# EasyEDA Pro project 四路舵机降压板.epro, schematic lm3150
Board Name: lm3150; Create Date: 2025-05-26; Page Name: P1; Project Name: 四路舵机降压板; Schematic Name: lm3150; Update Date: 2025-05-26; Company: 嘉立创EDA; Page Size: A4; Version: V1.0
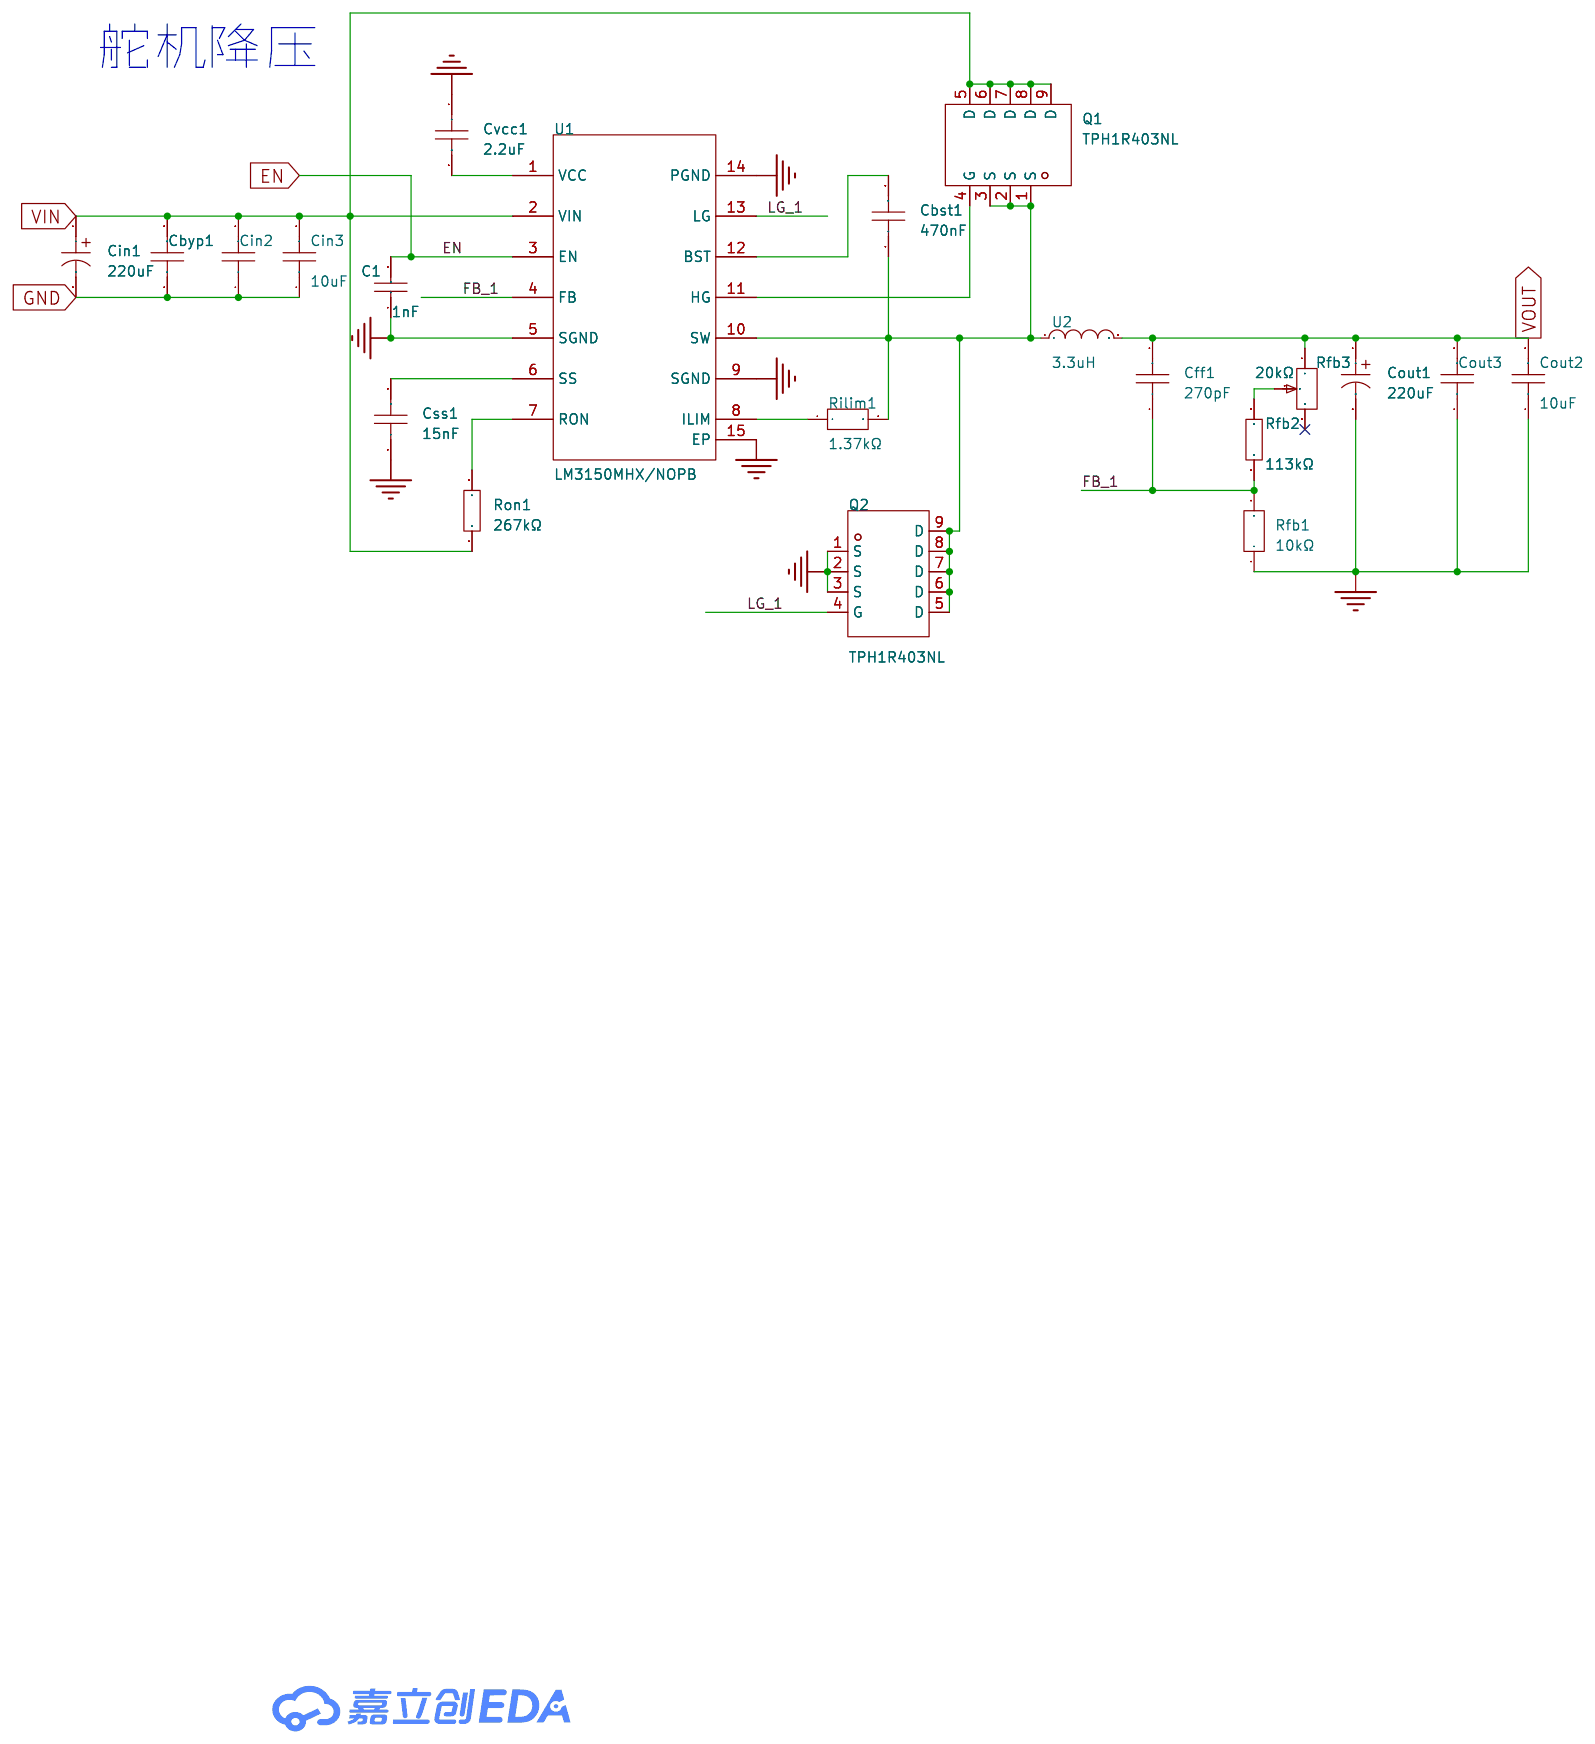
[diagram p2: schematic sheet]

## Parts
C1  1nF  [C0603]
Cbst1  470nF  [CAP-SMD_L1.6-W0.8-3]
Cbyp1  100nF  [C0603]
Cff1  270pF  [C0603]
Cin1  220uF  [CAP-SMD_BD6.3-L6.6-W6.6-LS7.4-FD]
Cin2  100nF  [C0603]
Cin3  10uF  [C0805]
Cout1  220uF  [CAP-SMD_BD6.3-L6.6-W6.6-LS7.4-FD]
Cout2  10uF  [C0805]
Cout3  100nF  [C0603]
Css1  15nF  [C0603]
Cvcc1  2.2uF  [C0805]
Q1  TPH1R403NL  [DSOP-8_L5.0-W5.0-P1.27-LS6.0-BL-EP]
Q2  TPH1R403NL  [DSOP-8_L5.0-W5.0-P1.27-LS6.0-BL-EP]
Rfb1  10kΩ  [R0603]
Rfb2  113kΩ  [R0603]
Rfb3  20kΩ  [RES-ADJ-TH_3362P]
Rilim1  1.37kΩ  [R0603]
Ron1  267kΩ  [R0603]
U1  LM3150MHX/NOPB  [HTSSOP-14_L5.0-W4.4-P0.65-LS6.4-BL-EP]
U2  3.3uH  [IND-SMD_L7.8-W7.6]

## Library data of the parts
C1 = CL10B102KB8NNNC: 容值:1nF;精度:±10%;额定电压:50V;材质(温度系数):X7R;; LCSC Part Name: 1nF ±10% 50V; Supplier Part: C1588; Manufacturer: SAMSUNG(三星); Supplier Footprint: 0603; JLCPCB Part Class: 基础库; Datasheet: https://atta.szlcsc.com/upload/public/pdf/source/20160218/1457707763339.pdf; Supplier: LCSC; Tolerance: ±10%; Voltage Rated: 50V; Temperature Coefficient: X7R
Cbst1 = CC0603KRX7R9BB474: 容值:470nF;精度:±10%;额定电压:50V;材质(温度系数):X7R;; LCSC Part Name: 470nF ±10% 50V; Supplier Part: C513577; Manufacturer: YAGEO(国巨); Supplier Footprint: 0603; JLCPCB Part Class: 扩展库; Datasheet: https://atta.szlcsc.com/upload/public/pdf/source/20200423/C519417_FF9998E3F66D767819CD86A66B468321.pdf; Supplier: LCSC; Tolerance: ±10%; Voltage Rated: 50V; Temperature Coefficient: X7R
Cbyp1 Cin2 Cout3 = CC0603KRX7R9BB104: 容值:100nF;精度:±10%;额定电压:50V;材质(温度系数):X7R;; LCSC Part Name: 100nF ±10% 50V; Supplier Part: C14663; Manufacturer: YAGEO(国巨); Supplier Footprint: 0603; JLCPCB Part Class: 基础库; Datasheet: https://atta.szlcsc.com/upload/public/pdf/source/20180910/C282072_33301C7F631E79921B82A8DAC6BCC5B3.pdf; Supplier: LCSC; Tolerance: ±10%; Voltage Rated: 50V; Temperature Coefficient: X7R
Cff1 = CL10C271JB8NNNC: 容值:270pF;精度:±5%;额定电压:50V;材质(温度系数):C0G;; LCSC Part Name: 270pF ±5% 50V; Supplier Part: C1657; Manufacturer: SAMSUNG(三星); Supplier Footprint: 0603; JLCPCB Part Class: 扩展库; Datasheet: https://atta.szlcsc.com/upload/public/pdf/source/20160218/1457707763339.pdf; Supplier: LCSC; Tolerance: ±5%; Voltage Rated: 50V; Temperature Coefficient: C0G
Cin1 Cout1 = RVT1E221M0607: 容值:220uF;精度:±20%;额定电压:25V;纹波电流:150mA@120Hz;等效串联电阻:-;; LCSC Part Name: 220uF ±20% 25V; Supplier Part: C2918361; Manufacturer: ROQANG(容强); Supplier Footprint: SMD,D6.3xL7.7mm; JLCPCB Part Class: 扩展库; Datasheet: https://atta.szlcsc.com/upload/public/pdf/source/20211118/497C0614266278696CA52BDF245B991F.pdf; Supplier: LCSC; Tolerance: ±20%; Rated Voltage: 25V; Ripple Current: 150mA@120Hz; φD: 6.3mm; L: 7.7mm; Lifetime @ Temp: 2000hrs@105℃; Operating Temperature: -40℃~+105℃
Cin3 Cout2 = GRM21BR61H106KE43L: 容值:10uF;精度:±10%;额定电压:50V;材质(温度系数):X5R;; LCSC Part Name: 10uF ±10% 50V; Supplier Part: C440198; Manufacturer: muRata(村田); Supplier Footprint: 0805; JLCPCB Part Class: 基础库; Datasheet: https://atta.szlcsc.com/upload/public/pdf/source/20230811/95AAE0C9AF55EDC31B7A4D8B733F534E.pdf; Supplier: LCSC; Tolerance: ±10%; Voltage Rated: 50V; Temperature Coefficient: X5R
Css1 = CC0603JRX7R9BB153: 容值:15nF;精度:±5%;额定电压:50V;材质(温度系数):X7R;; LCSC Part Name: 15nF ±5% 50V; Supplier Part: C519550; Manufacturer: YAGEO(国巨); Supplier Footprint: 0603; JLCPCB Part Class: 扩展库; Datasheet: https://atta.szlcsc.com/upload/public/pdf/source/20200423/C519550_A1941788CCD45C6ADF0AD0CE4A47CC49.pdf; Supplier: LCSC; Tolerance: ±5%; Voltage Rated: 50V; Temperature Coefficient: X7R
Cvcc1 = CL21A225KBQNNNE: 容值:2.2uF;精度:±10%;额定电压:50V;材质(温度系数):X5R;; LCSC Part Name: 2.2uF ±10% 50V; Supplier Part: C377773; Manufacturer: SAMSUNG(三星); Supplier Footprint: 0805; JLCPCB Part Class: 基础库; Datasheet: https://atta.szlcsc.com/upload/public/pdf/source/20160218/1457707763339.pdf; Supplier: LCSC; Tolerance: ±10%; Voltage Rated: 50V; Temperature Coefficient: X5R
Q1 Q2 = TPH1R403NL_C83440: 类型:1个N沟道;漏源电压(Vdss):30V;连续漏极电流(Id):150A;导通电阻(RDS(on)@Vgs,Id):1.7mΩ@4.5V,30A;功率:64W;阈值电压(Vgs(th)@Id):1.3V@0.5mA;; LCSC Part Name: 1个N沟道 耐压:30V 电流:150A; Supplier Part: C83440; Manufacturer: TOSHIBA(东芝); Supplier Footprint: DFN-8(5x6); JLCPCB Part Class: 扩展库; Datasheet: https://atta.szlcsc.com/upload/public/pdf/source/20170908/C83440_1504870121708958077.pdf; Supplier: LCSC; Type: 1个N沟道; Drain Source Voltage (Vdss): 30V; Continuous Drain Current (Id): 150A; Drain Source On Resistance (RDS(on)@Vgs,Id): 1.7mΩ@4.5V,30A; Power Dissipation (Pd): 64W; Gate Threshold Voltage (Vgs(th)@Id): 1.3V@0.5mA; Total Gate Charge (Qg@Vgs): 46nC@15V; Input Capacitance (Ciss@Vds): 3.4nF@15V; Reverse Transfer Capacitance (Crss@Vds): 200pF@15V; Operating Temperature: -55℃~+150℃
Rfb1 = FRC0603J103TS: 电阻类型:厚膜电阻;阻值:10kΩ;精度:±5%;功率:100mW;最大工作电压:75V;温度系数:±100ppm/℃;; LCSC Part Name: 10kΩ ±5% 100mW 厚膜电阻; Supplier Part: C2930027; Manufacturer: FOJAN(富捷); Supplier Footprint: 0603; JLCPCB Part Class: 扩展库; Datasheet: https://atta.szlcsc.com/upload/public/pdf/source/20211221/925EC7D7225764EE0046F22065062C87.pdf; Supplier: LCSC; Type: 厚膜电阻; Tolerance: ±5%; Power(Watts): 100mW; Overload Voltage (Max): 75V; Temperature Coefficient: ±100ppm/℃; Operating Temperature Range: -55℃~+155℃
Rfb2 = 0603WAF1003T5E: 电阻类型:厚膜电阻;阻值:100kΩ;精度:±1%;功率:100mW;最大工作电压:75V;温度系数:±100ppm/℃;; LCSC Part Name: 100kΩ ±1% 100mW 厚膜电阻; Supplier Part: C25803; Manufacturer: UNI-ROYAL(厚声); Supplier Footprint: 0603; JLCPCB Part Class: 基础库; Datasheet: https://atta.szlcsc.com/upload/public/pdf/source/20200306/C422600_1E6D84923E4A46A82E41ADD87F860B5C.pdf; Supplier: LCSC; Type: 厚膜电阻; Tolerance: ±1%; Power(Watts): 100mW; Overload Voltage (Max): 75V; Temperature Coefficient: ±100ppm/℃; Operating Temperature Range: -55℃~+155℃
Rfb3 = 3362P-1-203LF: 阻值:20kΩ;精度:±10%;功率:500mW;温度系数:±100ppm/℃;; LCSC Part Name: 20kΩ ±10%; Supplier Part: C81263; Manufacturer: BOURNS; Supplier Footprint: 插件-3P,7x6.6mm; JLCPCB Part Class: 扩展库; Datasheet: https://atta.szlcsc.com/upload/public/pdf/source/20170914/C124756_1505374041527969003.pdf; Supplier: LCSC; Tolerance: ±10%; Power(Watts): 500mW; Temperature Coefficient: ±100ppm/℃; Turns: 1
Rilim1 = RT0603CRE071K37L: 电阻类型:薄膜电阻;阻值:1.37kΩ;精度:±0.25%;功率:100mW;最大工作电压:75V;温度系数:±50ppm/℃;; LCSC Part Name: 薄膜电阻 1.37kΩ ±0.25% 100mW; Supplier Part: C705911; Manufacturer: YAGEO(国巨); Supplier Footprint: 0603; JLCPCB Part Class: 扩展库; Datasheet: https://atta.szlcsc.com/upload/public/pdf/source/20200720/C705911_C0C0480A0E18114730977775B5293834.pdf; Supplier: LCSC; Type: 薄膜电阻; Tolerance: ±0.25%; Power(Watts): 100mW; Overload Voltage (Max): 75V; Temperature Coefficient: ±50ppm/℃; Operating Temperature Range: -55℃~+155℃
Ron1 = 0603WAF2673T5E: 电阻类型:厚膜电阻;阻值:267kΩ;精度:±1%;功率:100mW;最大工作电压:75V;温度系数:±100ppm/℃;; LCSC Part Name: 267kΩ ±1% 100mW 厚膜电阻; Supplier Part: C22963; Manufacturer: UNI-ROYAL(厚声); Supplier Footprint: 0603; JLCPCB Part Class: 扩展库; Datasheet: https://atta.szlcsc.com/upload/public/pdf/source/20200306/C422600_1E6D84923E4A46A82E41ADD87F860B5C.pdf; Supplier: LCSC; Type: 厚膜电阻; Tolerance: ±1%; Power(Watts): 100mW; Overload Voltage (Max): 75V; Temperature Coefficient: ±100ppm/℃; Operating Temperature Range: -55℃~+155℃
U1 = LM3150MHX/NOPB: 功能类型:降压型;输出类型:可调;工作电压:6V~42V;输出电压:600mV~3.3V;输出电流:12A;; LCSC Part Name: LM3150 宽输入电压同步降压控制器; Supplier Part: C48112; Manufacturer: TI(德州仪器); Supplier Footprint: HTSSOP-14-EP; JLCPCB Part Class: 扩展库; Datasheet: https://www.ti.com/cn/lit/gpn/lm3150; Supplier: LCSC; Function: 降压型; Output Type: 可调; Input Voltage: 6V~42V; Output Voltage: 600mV~3.3V; Output Current: 12A; Switching Frequency: 500kHz; Operating Temperature: -40℃~+125℃; Synchronous Rectification: 是; Number of Outputs: 1; Topology: 降压式; Switch tube (built-in/external): 外置
U2 = YSPIT0770A-3R3M: 电感值:3.3uH;精度:±20%;额定电流:15.1A;饱和电流(Isat):19.4A;类型:一体成型电感;; LCSC Part Name: 3.3uH ±20% 19.4A; Supplier Part: C19190806; Manufacturer: YJYCOIN(益嘉源); Supplier Footprint: SMD,7.6x7.8mm; Datasheet: https://atta.szlcsc.com/upload/public/pdf/source/20231103/4584E541A7477EF2C0EF6FA736417A6E.pdf; Supplier: LCSC; Tolerance: ±20%; Rated Current: 15.1A; Saturation Current (Isat): 19.4A; DC Resistance (DCR): 9.5mΩ; Type: 一体成型电感

## Nets
GND: C1.1 Cbyp1.1 Cin1.2 Cin2.1 Cin3.1 Cout1.2 Cout2.1 Cout3.1 Css1.1 Cvcc1.1 Q2.1(S) Q2.2(S) Q2.3(S) Rfb1.1 U1.5(SGND) U1.9(SGND) U1.14(PGND) U1.15(EP)
VIN: Cbyp1.2 Cin1.1 Cin2.2 Cin3.2 Q1.5(D) Q1.6(D) Q1.7(D) Q1.8(D) Q1.9(D) Ron1.1 U1.2(VIN)
EN: C1.2 U1.3(EN)
FB_1: Cff1.1 Rfb1.2 Rfb2.1 U1.4(FB)
LG_1: Q2.4(G) U1.13(LG)
VOUT: Cff1.2 Cout1.1 Cout2.2 Cout3.2 Rfb3.1 U2.2
$1N1099: Css1.2 U1.6(SS)
$1N1101: Cvcc1.2 U1.1(VCC)
$1N1102: Ron1.2 U1.7(RON)
$1N1104: Q1.4(G) U1.11(HG)
$1N1105: Cbst1.2 U1.12(BST)
$1N1106: Rilim1.1 U1.8(ILIM)
$1N1119: Cbst1.1 Q1.1(S) Q1.2(S) Q1.3(S) Q2.5(D) Q2.6(D) Q2.7(D) Q2.8(D) Q2.9(D) Rilim1.2 U1.10(SW) U2.1
$1N1128: Rfb2.2 Rfb3.2

Not connected (* = marked no-connect by the designer): Rfb3 3*

## Notes on the sheet
- 舵机降压
